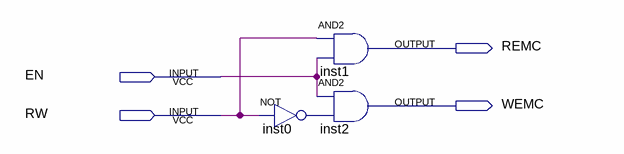
[diagram p0: schematic sheet]
// Quartus schematic IOController.bdf as structural Verilog: 3 symbols, 4 pins
module IOController (
  input  EN,
  input  RW,
  output REMC,
  output WEMC
);

  wire inst0_out;

  not inst0 (inst0_out, RW);
  and inst1 (REMC, RW, EN);
  and inst2 (WEMC, EN, inst0_out);
endmodule
